# Altium schematic sheet Power.SchDoc
size A4; Organization: Altium Limited; Address1: L3, 12a Rodborough Rd; Address2: Frenchs Forest; Address3: NSW; Address4: Australia 2086
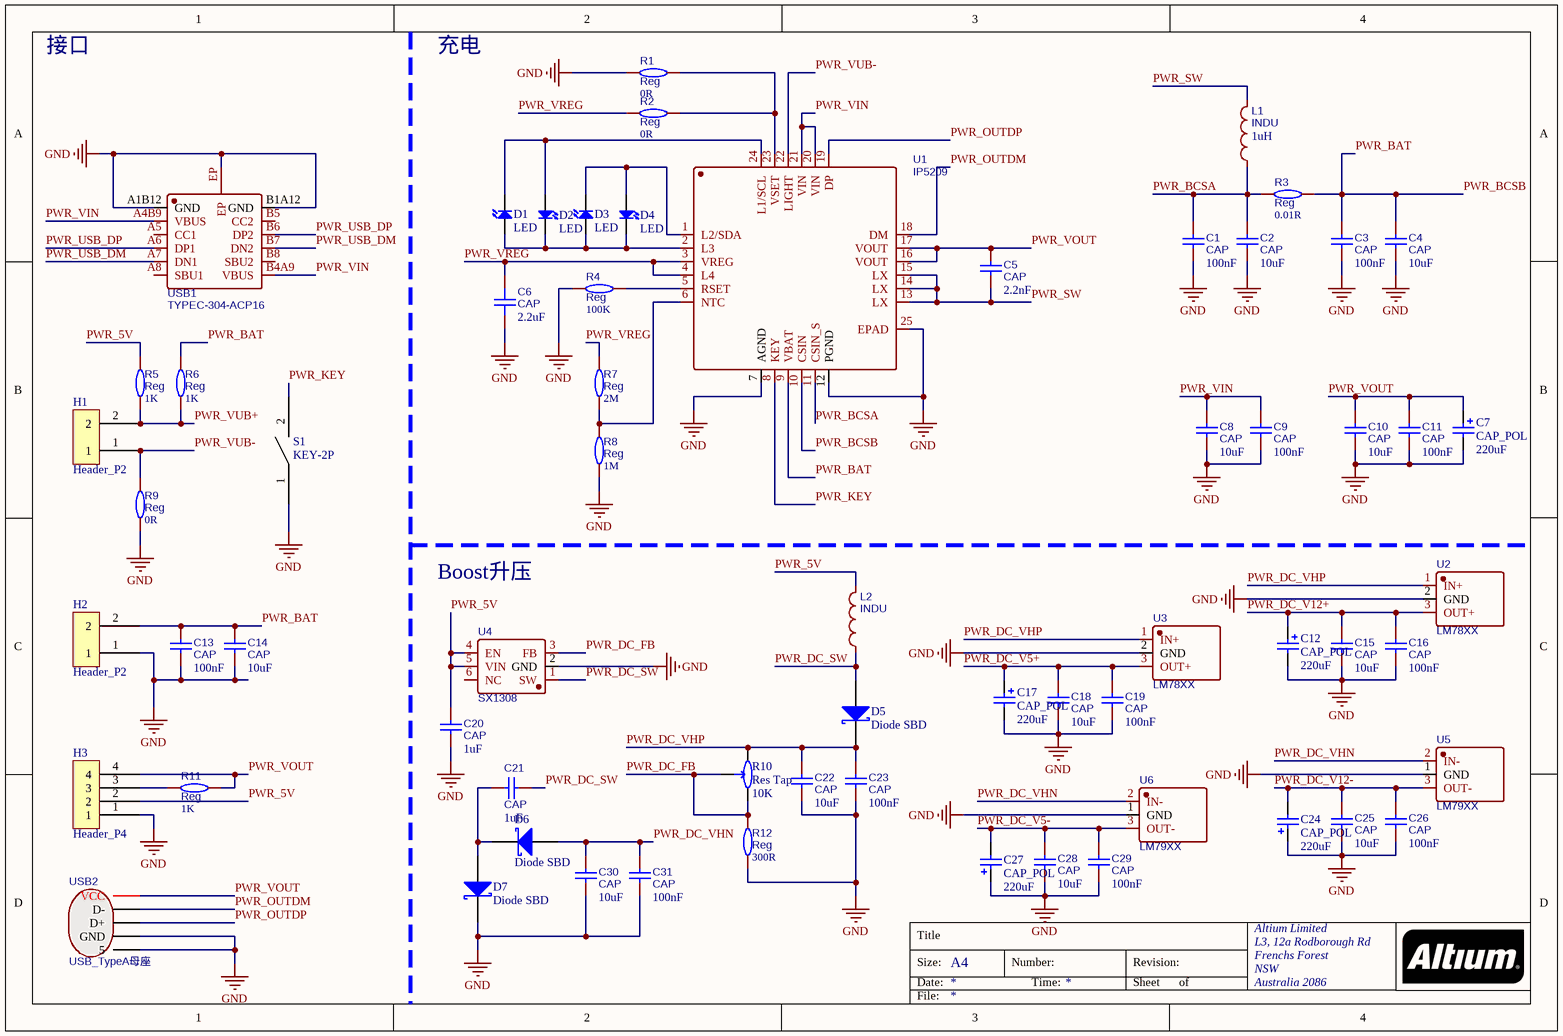
[diagram p0: Power.SchDoc]

## Parts
C1  CAP  value 100nF  [C0603]
C2  CAP  value 10uF  [C0603]
C3  CAP  value 100nF  [C0603]
C4  CAP  value 10uF  [C0603]
C5  CAP  value 2.2nF  [C0603]
C6  CAP  value 2.2uF  [C0603]
C7  CAP_POL  value 220uF  [CAP_SMD_6.3mm]
C8  CAP  value 10uF  [C0603]
C9  CAP  value 100nF  [C0603]
C10  CAP  value 10uF  [C0603]
C11  CAP  value 100nF  [C0603]
C12  CAP_POL  value 220uF  [CAP_SMD_6.3mm]
C13  CAP  value 100nF  [C0603]
C14  CAP  value 10uF  [C0603]
C15  CAP  value 10uF  [C0603]
C16  CAP  value 100nF  [C0603]
C17  CAP_POL  value 220uF  [CAP_SMD_6.3mm]
C18  CAP  value 10uF  [C0603]
C19  CAP  value 100nF  [C0603]
C20  CAP  value 1uF  [C0603]
C21  CAP  value 1uF  [C0603]
C22  CAP  value 10uF  [C0603]
C23  CAP  value 100nF  [C0603]
C24  CAP_POL  value 220uF  [CAP_SMD_6.3mm]
C25  CAP  value 10uF  [C0603]
C26  CAP  value 100nF  [C0603]
C27  CAP_POL  value 220uF  [CAP_SMD_6.3mm]
C28  CAP  value 10uF  [C0603]
C29  CAP  value 100nF  [C0603]
C30  CAP  value 10uF  [C0603]
C31  CAP  value 100nF  [C0603]
D1  LED  [LED0603_Side]
D2  LED  [LED0603_Side]
D3  LED  [LED0603_Side]
D4  LED  [LED0603_Side]
D5  Diode SBD  [SMA_L4.3]
D6  Diode SBD  [SMA_L4.3]
D7  Diode SBD  [SMA_L4.3]
H1  Header_P2  [H_2.54_P2]
H2  Header_P2  [H_2.54_P2]
H3  Header_P4  [H_2.54_P4]
L1  INDU  value 1uH  [SMD_L7.1]
L2  INDU  [SMD_L7.1]
R1  Reg  value 0R  [R0603]
R2  Reg  value 0R  [R0603]
R3  Reg  value 0.01R  [R1206]
R4  Reg  value 100K  [R0603]
R5  Reg  value 1K  [R0603]
R6  Reg  value 1K  [R0603]
R7  Reg  value 2M  [R0603]
R8  Reg  value 1M  [R0603]
R9  Reg  value 0R  [R0603]
R10  Res Tap  value 10K  [RES_TAP_HOR]
R11  Reg  value 1K  [R0603]
R12  Reg  value 300R  [R0603]
S1  KEY-2P  [KEY_SOT_P2]
U1  IP5209  [QFN-24]
U2  LM78XX  [TO-220-3_2.54_HOR]
U3  LM78XX  [TO-220-3_2.54_HOR]
U4  SX1308  [SOT-23-6]
U5  LM79XX  [TO-220-3_2.54_HOR]
U6  LM79XX  [TO-220-3_2.54_HOR]
USB1  TYPEC-304-ACP16  [USB-C-SMD_TYPE-C-16P]
USB2  USB_TypeA母座  [USB_TYPEA-SMD]

## Nets
GND: C1.2 C2.2 C3.2 C4.2 C6.2 C7.2 C8.2 C9.2 C10.2 C11.2 C12.2 C13.2 C14.2 C15.2 C16.2 C17.2 C18.2 C19.2 C20.2 C22.2 C23.2 C24.1 C25.2 C26.2 C27.1 C28.2 C29.2 C30.2 C31.2 D7.1(K) H2.1 H3.1 R1.2 R4.2 R8.2 R9.1 R12.1 S1.1 U1.7(AGND) U1.12(PGND) U1.25(EPAD) U2.2(GND) U3.2(GND) U4.2(GND) U5.1(GND) U6.1(GND) USB1.A1B12(GND) USB1.B1A12(GND) USB1.EP USB2.4(GND) USB2.5
PWR_5V: C20.1 H3.2 L2.2 R5.2 U4.4(EN) U4.5(VIN)
PWR_BAT: C3.1 C4.1 C13.1 C14.1 H2.2 R3.2 R6.2 U1.9(VBAT) U1.10(CSIN)  [also labelled PWR_BCSB]
PWR_BCSA: C1.1 C2.1 L1.1 R3.1 U1.11(CSIN_S)
PWR_DC_FB: R10.1(A) R10.3(TAP) R12.2 U4.3(FB)
PWR_DC_SW: C21.1 D5.2(A) L2.1 U4.1(SW)
PWR_DC_V5+: C17.1 C18.1 C19.1 U3.3(OUT+)
PWR_DC_V5-: C27.2 C28.1 C29.1 U6.3(OUT-)
PWR_DC_V12+: C12.1 C15.1 C16.1 U2.3(OUT+)
PWR_DC_V12-: C24.2 C25.1 C26.1 U5.3(OUT-)
PWR_DC_VHN: C30.1 C31.1 D6.2(A) U5.2(IN-) U6.2(IN-)
PWR_DC_VHP: C22.1 C23.1 D5.1(K) R10.2(B) U2.1(IN+) U3.1(IN+)
PWR_KEY: S1.2 U1.8(KEY)
PWR_OUTDM: U1.18(DM) USB2.2(D-)
PWR_OUTDP: U1.19(DP) USB2.3(D+)
PWR_SW: C5.2 L1.2 U1.13(LX) U1.14(LX) U1.15(LX)
PWR_USB_DM: USB1.A7(DN1) USB1.B7(DN2)
PWR_USB_DP: USB1.A6(DP1) USB1.B6(DP2)
PWR_VIN: C8.1 C9.1 U1.20(VIN) U1.21(VIN) USB1.A4B9(VBUS) USB1.B4A9(VBUS)
PWR_VOUT: C5.1 C7.1 C10.1 C11.1 H3.4 R11.1 U1.16(VOUT) U1.17(VOUT) USB2.1(VCC)
PWR_VREG: C6.1 R2.2 R7.1 U1.3(VREG) U1.4(L4)
PWR_VUB+: H1.2 R5.1 R6.1
PWR_VUB-: H1.1 R9.2 U1.22(LIGHT)
NetC21_2: C21.2 D6.1(K) D7.2(A)
NetD1_1: D1.1(K) D2.2(A) U1.24(L1/SCL)
NetD1_2: D1.2(A) D2.1(K) D3.2(A) D4.1(K) U1.2(L3)
NetD3_1: D3.1(K) D4.2(A) U1.1(L2/SDA)
NetH3_3: H3.3 R11.2
NetR1_1: R1.1 R2.1 U1.23(VSET)
NetR4_1: R4.1 U1.5(RSET)
NetR7_2: R7.2 R8.1 U1.6(NTC)

Not connected (* = marked no-connect by the designer): U4 6(NC); USB1 A5(CC1) A8(SBU1) B5(CC2) B8(SBU2)

## Notes on the sheet
- 接口
- 充电
- Boost升压
- Title
- Size:
- Date:
- A4
- Number:
- Time:
- Revision:
- Sheet
- of
- File:

## Library data of the parts
C1-C6 C8-C11 C13-C16 C18-C23 C25 C26 C28-C31 = CAP: BOM_Manufacturer: Huaxin S&T; BOM_Manufacturer Part: 0603B103K101CT; nameAlias: Capacitance; Contributor: LCSC; BOM_Supplier: LCSC; BOM_Supplier Part: C302008; spicePre: C; spiceSymbolName: 0603B103K101CT
C7 C12 C17 C24 C27 = CAP_POL: 极性电容
D1-D4 = LED0: Published: 8-Jun-2000; LatestRevisionDate: 08-Jul-2005; LatestRevisionNote: Mech Layer 1 removed.; PackageReference: LED-0; Publisher: Altium Limited; PackageDescription: LED; 2 Leads
D5-D7 = Diode SBD: Schottky Rectifier; Note: Terminal 2 is the TAB and is electrically connected to the cathode; Published: 8-Jun-2000; LatestRevisionDate: 17-Jul-2002; LatestRevisionNote: Re-released for DXP Platform.; DatasheetVersion: PD-2.057B; PackageVersion: Feb-1998; PackageReference: TO-220AC; Publisher: Altium Limited; PackageDescription: TO, Thru-Hole, Vertical, Heatsink Mounted; 3 In-Line Leads (1 Absent); Pitch 2.54 mm; ComponentLink1Description: Manufacturer Link; ComponentLink1URL: http://www.irf.com/; ComponentLink2Description: Datasheet; ComponentLink2URL: http://www.irf.com/product-info/datasheets/data/10tq.pdf
H1 H2 = Header_P2: 2Pin排针
H3 = Header_P4: 4Pin排针
L1 L2 = IND: 电感; BOM_Manufacturer: Sunltech Tech; BOM_Manufacturer Part: SLO0630H150MTT; nameAlias: Inductance; Contributor: LCSC; BOM_Supplier: LCSC; BOM_Supplier Part: C182182; BOM_JLCPCB Part Class: Extended Part; spicePre: L; spiceSymbolName: SLO0630H150MTT
  L2: Value: *
R1-R9 R11 R12 = Res: 电阻; BOM_Manufacturer: Viking Tech; BOM_Manufacturer Part: AR03BTCX1002A; nameAlias: Resistance (Ohms); Contributor: LCSC; BOM_Supplier: LCSC; BOM_Supplier Part: C465721; spicePre: R; spiceSymbolName: AR03BTCX1002A
R10 = Res Tap: 可调电阻; Sim Note: Enter the Resistance value and the set point into parameter fields.; Set Position: 0.5; Published: 24-Mar-1999; LatestRevisionDate: 17-Jul-2002; LatestRevisionNote: Re-released for DXP Platform.; PackageReference: VR3; Publisher: Altium Limited; PackageDescription: Variable Resistor, Thru-Hole; 3 Leads
S1 = KEY_2P: KEY-2Pp
U1 = IP5209: USB充电宝; BOM_Manufacturer: INJOINIC; Contributor: LCSC; BOM_Supplier: LCSC; BOM_Supplier Part: C181695; BOM_Manufacturer Part: IP5209; BOM_JLCPCB Part Class: Extended Part; spicePre: U; spiceSymbolName: IP5209
U2 U3 = LM78XX: 三端稳压(正电压); BOM_Manufacturer: HGSEMI(华冠); BOM_Manufacturer Part: LM7812T; Contributor: LCSC; BOM_Supplier: LCSC; BOM_Supplier Part: C2902509; BOM_JLCPCB Part Class: Extended Part; spicePre: U; spiceSymbolName: LM7812T
U4 = SX1308: 升压PWM; BOM_Manufacturer: SX; sourceId: g4Yg9rJ1j; timeStamp: 1472247539; BOM_Supplier: LCSC; BOM_Manufacturer Part: SX1308; BOM_Supplier Part: C78162; BOM_JLCPCB Part Class: Extended Part; spicePre: U; spiceSymbolName: SX1308
U5 U6 = LM79XX: 三端稳压(负电压); BOM_Manufacturer: HGSEMI(华冠); BOM_Manufacturer Part: LM7812T; Contributor: LCSC; BOM_Supplier: LCSC; BOM_Supplier Part: C2902509; BOM_JLCPCB Part Class: Extended Part; spicePre: U; spiceSymbolName: LM7812T
USB1 = USB_TYPEC_12P: 全引脚USB TYPEC母座; BOM_Manufacturer: XUNPU(讯普); Contributor: LCSC; BOM_Supplier: LCSC; BOM_Supplier Part: C2982555; BOM_Manufacturer Part: TYPEC-304-ACP16; BOM_JLCPCB Part Class: Extended Part; spicePre: U; spiceSymbolName: TYPEC-304-ACP16
USB2 = USB-TYPEA: BOM_Manufacturer: ValuePro; BOM_Manufacturer Part: YJ-USB-AF-SMT-01; BOM_Supplier: LCSC; BOM_Supplier Part: C8328; BOM_JLCPCB Part Class: Extended Part; spicePre: U; spiceSymbolName: YJ-USB-AF-SMT-01